# Altium schematic sheet Linear regulators.SchDoc (part 2 of 3)
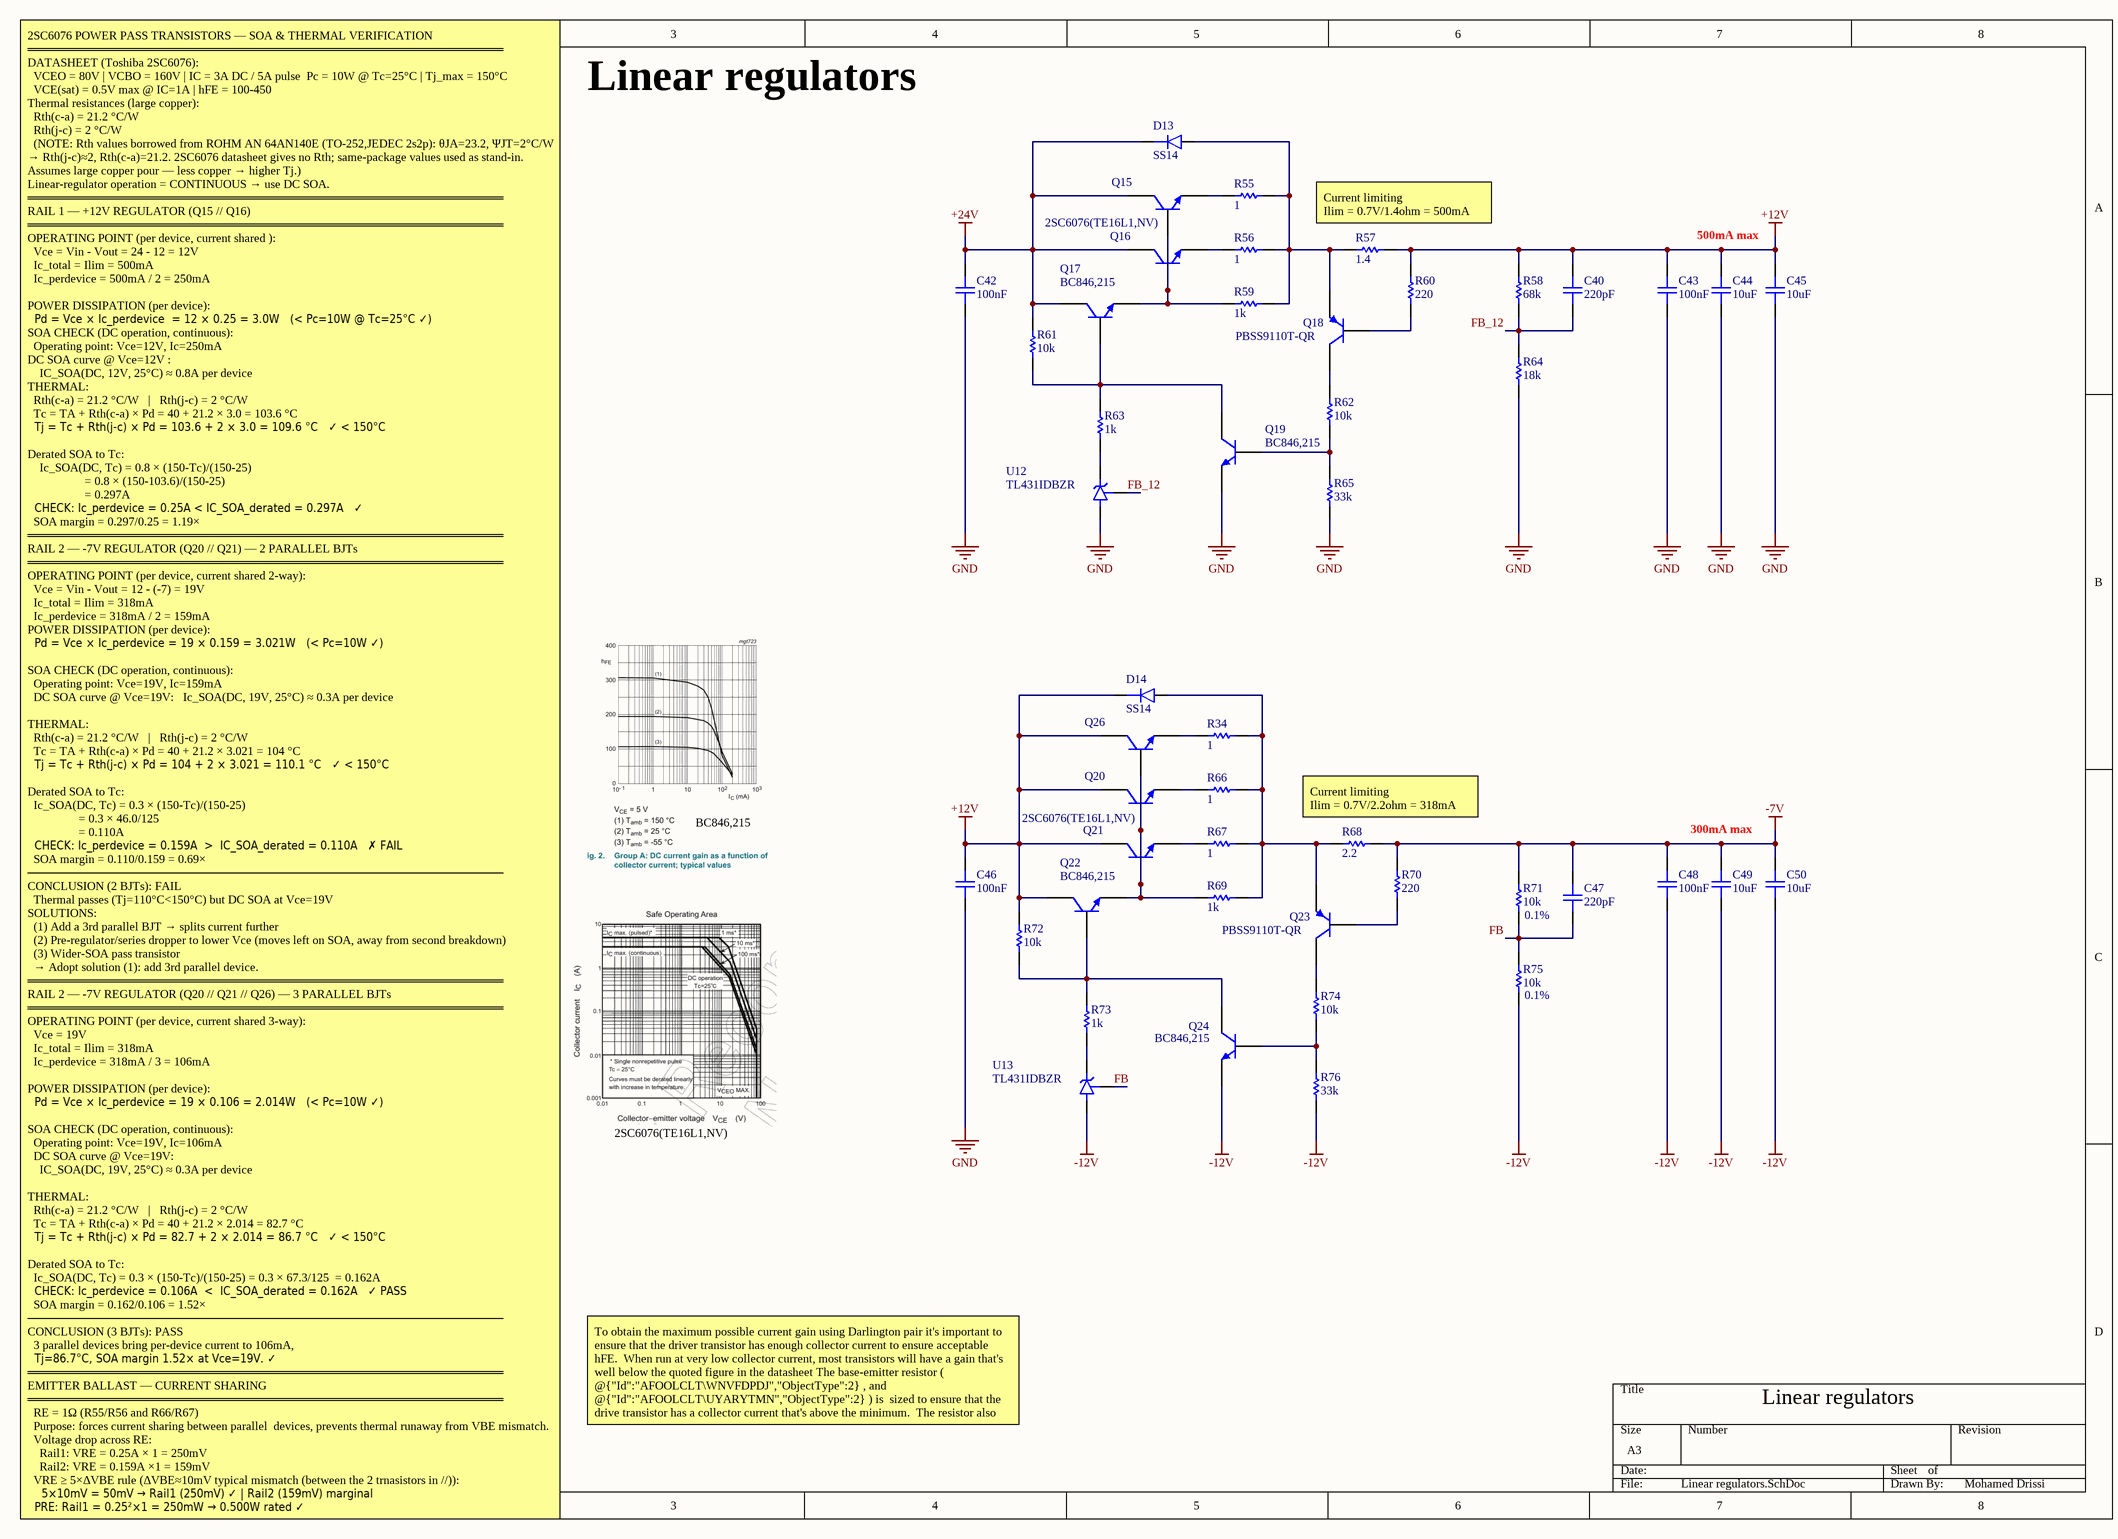
[diagram p1: Linear regulators.SchDoc]
## Library data of the parts
C40 C47 = Yageo CC0603JRNPO7BN221: 16V 220pF C0G ±5% 0603 Multilayer Ceramic Capacitors MLCC - SMD/SMT ROHS; Manufacturer: Yageo Group; Supplier: DigiKey; Supplier Part Number: 311-3948-1-ND; Manufacturer Part Number: CC0603JRNPO7BN221; RoHS: Compliant; Category: Ceramic Capacitors; Stock: 42536; Pricing: 1=0,1, 10=0,045, 50=0,0304, 100=0,0261, 500=0,0189, 1000=0,01669 (USD); Case/Package: 0603; China RoHS: Compliant; Dielectric Material: Ceramic; Halogen Free: Halogen Free; Height: 800µm; Lead Free: Lead Free; Length: 1.6mm; Lifecycle Status: Production; Max Operating Temperature: 125°C; Min Operating Temperature: -55°C; Mounting Technology: Surface Mount; Number of Terminals: 2; REACH SVHC: Yes; Thickness: 889µm; Tolerance: 5%; Voltage Rating: 16V; Voltage Rating (DC): 16V; Width: 800µm; ComponentLink1URL: https://datasheet.octopart.com:443/CC0603JRNPO7BN221-Yageo-datasheet-182140217.pdf?src-supplier=IHS; ComponentLink1Description: https://datasheet.octopart.com:443/CC0603JRNPO7BN221-Yageo-datasheet-182140217.pdf?src-supplier=IHS; ComponentLink2URL: https://datasheet.octopart.com:443/CC0603JRNPO7BN221-Yageo-datasheet-151948684.pdf?src-supplier=HQonline; ComponentLink2Description: https://datasheet.octopart.com:443/CC0603JRNPO7BN221-Yageo-datasheet-151948684.pdf?src-supplier=HQonline; ComponentLink3URL: https://datasheet.octopart.com:443/CC0603JRNPO7BN221-Yageo-datasheet-182965582.pdf?src-supplier=Farnell; ComponentLink3Description: https://datasheet.octopart.com:443/CC0603JRNPO7BN221-Yageo-datasheet-182965582.pdf?src-supplier=Farnell; ComponentLink4URL: https://datasheet.octopart.com:443/CC0603JRNPO7BN221-Yageo-datasheet-137875056.pdf?src-supplier=Future+Electronics; ComponentLink4Description: https://datasheet.octopart.com:443/CC0603JRNPO7BN221-Yageo-datasheet-137875056.pdf?src-supplier=Future+Electronics; ComponentLink5URL: http://sigma.octopart.com:80/rohs_statement/Yageo-company-2.pdf?src-supplier=Compliance+Statements; ComponentLink5Description: http://sigma.octopart.com:80/rohs_statement/Yageo-company-2.pdf?src-supplier=Compliance+Statements; ComponentLink6URL: http://sigma.octopart.com:80/conflict_mineral_statement/Yageo-company-3.pdf?src-supplier=Compliance+Statements; ComponentLink6Description: http://sigma.octopart.com:80/conflict_mineral_statement/Yageo-company-3.pdf?src-supplier=Compliance+Statements
C42 C43 C46 C48 = Cal-chip GMC10X7R104K100NT: 100V 100nF X7R ±10% 0603 Multilayer Ceramic Capacitors MLCC - SMD/SMT ROHS; Manufacturer: Cal-Chip Electronics; Supplier: DigiKey; Supplier Part Number: 4713-GMC10X7R104K100NTCT-ND; Manufacturer Part Number: GMC10X7R104K100NT; RoHS: Compliant; Category: Ceramic Capacitors; Stock: 34767; Pricing: 1=0,1, 10=0,045, 50=0,0306, 100=0,0262, 500=0,01902, 1000=0,0168 (USD); Case/Package: 0603; China RoHS: Compliant; Dielectric Material: Ceramic; Height: 950µm; Length: 1.6mm; Lifecycle Status: Production; Max Operating Temperature: 125°C; Min Operating Temperature: -55°C; Mounting Technology: Surface Mount; Number of Terminals: 2; REACH SVHC: Yes; Voltage Rating (DC): 100V; Width: 800µm; ComponentLink1URL: https://datasheet.octopart.com:443/GMC10X7R104K100NT-Cal-Chip-Electronics-datasheet-182028815.pdf?src-supplier=IHS; ComponentLink1Description: https://datasheet.octopart.com:443/GMC10X7R104K100NT-Cal-Chip-Electronics-datasheet-182028815.pdf?src-supplier=IHS
C44 C45 C49 C50 = Wurth 885012209073: Cap, 10Uf, 50V, Mlcc, 1210 Rohs Compliant: Yes |Würth Elektronik 885012209073; Manufacturer: Wurth Elektronik; Manufacturer Lifecycle Status: ACTIVE; Insulation Resistance: 10MΩ; Material: Ceramic; Tolerance: 10%; YEOL: 1 = Estimated lifetime > 10 years; Supplier: RS; Supplier Part Number: 2571123; Manufacturer Part Number: 885012209073; RoHS: Compliant; Category: Ceramic Capacitors; Stock: 1289; Pricing: 10=1,153, 100=1,081, 200=1,009, 400=0,851, 500=0,799 (EUR); Case/Package: 1210; Height: 2.5mm; Length: 3.2mm; Lifecycle Status: Production; Max Operating Temperature: 125°C; Min Operating Temperature: -55°C; Voltage Rating: 50V; Width: 2.5mm; ComponentLink1URL: https://datasheet.octopart.com:443/885012209073-Wurth-Elektronik-datasheet-166092699.pdf?src-supplier=Newark; ComponentLink1Description: https://datasheet.octopart.com:443/885012209073-Wurth-Elektronik-datasheet-166092699.pdf?src-supplier=Newark; ComponentLink2URL: https://datasheet.octopart.com:443/885012209073-W%C3%BCrth-Elektronik-datasheet-137006727.pdf?src-supplier=Wurth+Elektronik; ComponentLink2Description: https://datasheet.octopart.com:443/885012209073-W%C3%BCrth-Elektronik-datasheet-137006727.pdf?src-supplier=Wurth+Elektronik
D13 D14 = Onsemi SS14: SS14 Series 500 mV 1 A 40 V Max Reverse Voltage Schottky Rectifier - DO-214AC; Manufacturer: onsemi; Manufacturer Lifecycle Status: ACTIVE; Average Rectified Current: 1A; Element Configuration: Single; Forward Voltage: 500mV; Max Forward Surge Current (Ifsm): 30A; Max Junction Temperature (Tj): 125°C; Max Power Dissipation: 1.1W; Max Repetitive Reverse Voltage (Vrrm): 40V; Number of Elements: 1; Peak Non-Repetitive Surge Current: 40A; Peak Reverse Current: 200µA; Polarity: Standard; Voltage: 30V; Supplier: RS; Supplier Part Number: 7390467; Manufacturer Part Number: SS14; RoHS: Compliant; Category: Schottky Diodes; Stock: 1060; Pricing: 5=0,274, 50=0,236, 100=0,204, 500=0,18, 1000=0,164 (EUR); Case/Package: SMA; China RoHS: Non-Compliant; Country of Origin: Mainland China; Current: 1A; Current Rating: 1A; Export Control Classification Number (ECCN) Code: EAR99; Forward Current: 1A; Height: 2.5mm; Harmonized Tariff Schedule (HTS) Code: 8541.10.00.80; Introduction Date: 1998-01-01; Lead Free: Lead Free; Length: 4.6mm; Lifecycle Status: Production; Max Operating Temperature: 125°C; Max Output current: 1A; Max Reverse Voltage (DC): 40V; Min Operating Temperature: -65°C; Mounting Technology: Surface Mount; Pins: 2; Number of Terminals: 2; Output Current: 1A; Packaging: Cut Tape; Power Dissipation: 1.1W; Radiation Hardening: No; REACH SVHC: No; Reverse Standoff Voltage: 40V; Schedule B: 8541100080, 8541100080|8541100080|8541100080|8541100080|8541100080|8541100080|8541100080|8541100080|8541100080|8541100080|8541100080|8541100080|8541100080|8541100080|8541100080|8541100080|8541100080|8541100080|8541100080|8541100080|8541100080|8541100080|8541100080|85; Termination: SMD/SMT; Voltage Rating (DC): 40V; Weight: 105.998867mg; Width: 2.9mm; ComponentLink1URL: https://datasheet.octopart.com:443/SS14-onsemi-datasheet-180969535.pdf?src-supplier=IHS; ComponentLink1Description: https://datasheet.octopart.com:443/SS14-onsemi-datasheet-180969535.pdf?src-supplier=IHS; ComponentLink2URL: https://datasheet.octopart.com:443/SS14-Fairchild-Semiconductor-datasheet-37002494.pdf?src-supplier=IHS; ComponentLink2Description: https://datasheet.octopart.com:443/SS14-Fairchild-Semiconductor-datasheet-37002494.pdf?src-supplier=IHS; ComponentLink3URL: https://datasheet.octopart.com:443/SS14-ON-Semiconductor-datasheet-137256445.pdf?src-supplier=Electro+Sonic; ComponentLink3Description: https://datasheet.octopart.com:443/SS14-ON-Semiconductor-datasheet-137256445.pdf?src-supplier=Electro+Sonic; ComponentLink4URL: https://datasheet.octopart.com:443/SS14-ON-Semiconductor-datasheet-119409881.pdf?src-supplier=onsemi; ComponentLink4Description: https://datasheet.octopart.com:443/SS14-ON-Semiconductor-datasheet-119409881.pdf?src-supplier=onsemi; ComponentLink5URL: https://datasheet.octopart.com:443/SS14-ON-Semiconductor-datasheet-86698600.pdf?src-supplier=onsemi; ComponentLink5Description: https://datasheet.octopart.com:443/SS14-ON-Semiconductor-datasheet-86698600.pdf?src-supplier=onsemi; ComponentLink6URL: https://datasheet.octopart.com:443/SS14-ON-Semiconductor-datasheet-21199495.pdf?src-supplier=Future+Electronics; ComponentLink6Description: https://datasheet.octopart.com:443/SS14-ON-Semiconductor-datasheet-21199495.pdf?src-supplier=Future+Electronics; ComponentLink7URL: https://datasheet.octopart.com:443/SS14.-Fairchild-Semiconductor-datasheet-3545.pdf?src-supplier=element14+APAC; ComponentLink7Description: https://datasheet.octopart.com:443/SS14.-Fairchild-Semiconductor-datasheet-3545.pdf?src-supplier=element14+APAC; ComponentLink8URL: https://datasheet.octopart.com:443/SS14-Fairchild-Semiconductor-datasheet-67132011.pdf?src-supplier=element14+APAC; ComponentLink8Description: https://datasheet.octopart.com:443/SS14-Fairchild-Semiconductor-datasheet-67132011.pdf?src-supplier=element14+APAC; ComponentLink9URL: https://datasheet.octopart.com:443/SS14-Fairchild-Semiconductor-datasheet-68481721.pdf?src-supplier=element14+APAC; ComponentLink9Description: https://datasheet.octopart.com:443/SS14-Fairchild-Semiconductor-datasheet-68481721.pdf?src-supplier=element14+APAC; ComponentLink10URL: https://datasheet.octopart.com:443/SS14-onsemi-datasheet-178499215.pdf?src-supplier=Newark; ComponentLink10Description: https://datasheet.octopart.com:443/SS14-onsemi-datasheet-178499215.pdf?src-supplier=Newark; ComponentLink11URL: https://datasheet.octopart.com:443/SS14-Fairchild-Semiconductor-datasheet-67356306.pdf?src-supplier=Newark; ComponentLink11Description: https://datasheet.octopart.com:443/SS14-Fairchild-Semiconductor-datasheet-67356306.pdf?src-supplier=Newark; ComponentLink12URL: https://datasheet.octopart.com:443/SS14-Fairchild-Semiconductor-datasheet-67879033.pdf?src-supplier=Newark; ComponentLink12Description: https://datasheet.octopart.com:443/SS14-Fairchild-Semiconductor-datasheet-67879033.pdf?src-supplier=Newark; ComponentLink13URL: https://datasheet.octopart.com:443/SS14-ON-Semiconductor-datasheet-86692975.pdf?src-supplier=Farnell; ComponentLink13Description: https://datasheet.octopart.com:443/SS14-ON-Semiconductor-datasheet-86692975.pdf?src-supplier=Farnell; ComponentLink14URL: https://datasheet.octopart.com:443/SS14-onsemi-datasheet-137710389.pdf?src-supplier=TME; ComponentLink14Description: https://datasheet.octopart.com:443/SS14-onsemi-datasheet-137710389.pdf?src-supplier=TME; ComponentLink15URL: https://datasheet.octopart.com:443/SS14-ON-Semiconductor-datasheet-78863395.pdf?src-supplier=TME; ComponentLink15Description: https://datasheet.octopart.com:443/SS14-ON-Semiconductor-datasheet-78863395.pdf?src-supplier=TME; ComponentLink16URL: https://sigma.octopart.com:443/17345279/technical_drawing/Fairchild-Semiconductor-SS14..pdf?src-supplier=Fairchild+Semiconductor; ComponentLink16Description: https://sigma.octopart.com:443/17345279/technical_drawing/Fairchild-Semiconductor-SS14..pdf?src-supplier=Fairchild+Semiconductor; ComponentLink17URL: https://datasheet.octopart.com:443/SS14.-Fairchild-Semiconductor-datasheet-8381571.pdf?src-supplier=Jameco; ComponentLink17Description: https://datasheet.octopart.com:443/SS14.-Fairchild-Semiconductor-datasheet-8381571.pdf?src-supplier=Jameco; ComponentLink18URL: http://sigma.octopart.com:80/150631693/rohs_statement/ON-Semiconductor-SS14.pdf?src-supplier=Compliance+Statements; ComponentLink18Description: http://sigma.octopart.com:80/150631693/rohs_statement/ON-Semiconductor-SS14.pdf?src-supplier=Compliance+Statements; ComponentLink19URL: http://sigma.octopart.com:80/17357451/materials_sheet/Fairchild-Semiconductor-SS14..pdf?src-supplier=Compliance+Statements; ComponentLink19Description: http://sigma.octopart.com:80/17357451/materials_sheet/Fairchild-Semiconductor-SS14..pdf?src-supplier=Compliance+Statements; ComponentLink20URL: http://sigma.octopart.com:80/17357450/reach_statement/Fairchild-Semiconductor-SS14..pdf?src-supplier=Compliance+Statements; ComponentLink20Description: http://sigma.octopart.com:80/17357450/reach_statement/Fairchild-Semiconductor-SS14..pdf?src-supplier=Compliance+Statements; ComponentLink21URL: http://sigma.octopart.com:80/33331861/reach_statement/Fairchild-Semiconductor-SS14..pdf?src-supplier=Compliance+Statements; ComponentLink21Description: http://sigma.octopart.com:80/33331861/reach_statement/Fairchild-Semiconductor-SS14..pdf?src-supplier=Compliance+Statements; ComponentLink22URL: http://sigma.octopart.com:80/33331862/materials_sheet/Fairchild-Semiconductor-SS14..pdf?src-supplier=Compliance+Statements; ComponentLink22Description: http://sigma.octopart.com:80/33331862/materials_sheet/Fairchild-Semiconductor-SS14..pdf?src-supplier=Compliance+Statements; ComponentLink23URL: http://sigma.octopart.com:80/reach_statement/ON-Semiconductor-company-79.pdf?src-supplier=Compliance+Statements; ComponentLink23Description: http://sigma.octopart.com:80/reach_statement/ON-Semiconductor-company-79.pdf?src-supplier=Compliance+Statements; ComponentLink24URL: http://sigma.octopart.com:80/rohs_statement/Fairchild-Semiconductor-company-11.pdf?src-supplier=Compliance+Statements; ComponentLink24Description: http://sigma.octopart.com:80/rohs_statement/Fairchild-Semiconductor-company-11.pdf?src-supplier=Compliance+Statements; ComponentLink25URL: http://sigma.octopart.com:80/rohs_statement/Fairchild-Semiconductor-company-10.pdf?src-supplier=Compliance+Statements; ComponentLink25Description: http://sigma.octopart.com:80/rohs_statement/Fairchild-Semiconductor-company-10.pdf?src-supplier=Compliance+Statements; ComponentLink26URL: http://sigma.octopart.com:80/reach_statement/Fairchild-Semiconductor-company-9.pdf?src-supplier=Compliance+Statements; ComponentLink26Description: http://sigma.octopart.com:80/reach_statement/Fairchild-Semiconductor-company-9.pdf?src-supplier=Compliance+Statements; ComponentLink27URL: https://octopart.com:443/opatz8j6/c1?t=Bw0gF7dTHBBNgIRwmL-w_2CyYL2SBkPqmv81bh-l31_h4wWg3_a04vj5nygZPKjJEbqCn-V3QJKPEtJbJZ9dK76nf60b1hnFYSb2utlv1JMZ7nt7LZDcLJB6MnS0HXUMNymQ9MKHht22UTBn3FPLIAeU_nKjXm585aLMzgts1grjV1usOojzByqPrb06YMMbaH2DemZtlAMpdE8kThGW13fMNBaSLxUaqaEw9yCul6wsHG4N0hle5kO4fDo68Lm_qc0J9mjVS1cKqi_KRYcR4HzMEZdKKCtujOS1LtQ51mEG8ds8yMcLACJrlGl72MtFCtRQExHmh1A08LYIe9nE1jxUQxpaAYU&src-supplier=Compliance+Statements; ComponentLink27Description: https://octopart.com:443/opatz8j6/c1?t=Bw0gF7dTHBBNgIRwmL-w_2CyYL2SBkPqmv81bh-l31_h4wWg3_a04vj5nygZPKjJEbqCn-V3QJKPEtJbJZ9dK76nf60b1hnFYSb2utlv1JMZ7nt7LZDcLJB6MnS0HXUMNymQ9MKHht22UTBn3FPLIAeU_nKjXm585aLMzgts1grjV1usOojzByqPrb06YMMbaH2DemZtlAMpdE8kThGW13fMNBaSLxUaqaEw9yCul6wsHG4N0hle5kO4fDo68Lm_qc0J9mjVS1cKqi_KRYcR4HzMEZdKKCtujOS1LtQ51mEG8ds8yMcLACJrlGl72MtFCtRQExHmh1A08LYIe9nE1jxUQxpaAYU&src-supplier=Compliance+Statements; ComponentLink28URL: https://octopart.com:443/opatz8j6/c1?t=Oy9Y_xQ8UBTUdj6PwzXwp1zs71_1odZp0ZU_YgdGe4cRGR2grA12wzMk0vFreugSMOPhDRboFjT3DxMxky9bE1pRs3RzwJ4HuhrWPX0Rvf9JkcZ-KzK2E-hTxLa87m8fCG3QDeTdPLKe0q9nCHkQ9Fq-P1zjt1qPa8QNtTjCwRNLV7KQZ0akwYUkHij7z86lA5yyHwuacyylqSQdeLnxu4qSYfmPMgjMEw-ejaQVRBCjOvHtUB15Vc3ByBR5f7PieHEl4NkUuljoGV4a9YtBLQqKu7wBh9trMegOXFlGaLSEvBsdfJivtg_oNHsdlAJBiRoCdT3_Ib8N5sEl_iSFZc4efKmkxQ&src-supplier=Compliance+Statements; ComponentLink28Description: https://octopart.com:443/opatz8j6/c1?t=Oy9Y_xQ8UBTUdj6PwzXwp1zs71_1odZp0ZU_YgdGe4cRGR2grA12wzMk0vFreugSMOPhDRboFjT3DxMxky9bE1pRs3RzwJ4HuhrWPX0Rvf9JkcZ-KzK2E-hTxLa87m8fCG3QDeTdPLKe0q9nCHkQ9Fq-P1zjt1qPa8QNtTjCwRNLV7KQZ0akwYUkHij7z86lA5yyHwuacyylqSQdeLnxu4qSYfmPMgjMEw-ejaQVRBCjOvHtUB15Vc3ByBR5f7PieHEl4NkUuljoGV4a9YtBLQqKu7wBh9trMegOXFlGaLSEvBsdfJivtg_oNHsdlAJBiRoCdT3_Ib8N5sEl_iSFZc4efKmkxQ&src-supplier=Compliance+Statements
Q15 Q16 Q20 Q21 Q26 = Toshihba 2SC6076(TE16L1,NV): Power Bipolar Transistor, 3A I(C), 80V V(BR)CEO, 1-Element, NPN, Silicon, Plastic/Epoxy, 2 Pin; Manufacturer: Toshiba; Collector Emitter Saturation Voltage: 500mV; hFE Min: 100; Max Power Dissipation: 10W; Number of Elements: 1; Transition Frequency: 150MHz; Supplier: DigiKey; Supplier Part Number: 2SC6076(TE16L1NV)CT-ND; Manufacturer Part Number: 2SC6076(TE16L1,NV); RoHS: Compliant; Category: BJTs; Stock: 1540; Pricing: 1=0,96, 10=0,599, 100=0,3888, 500=0,29846, 1000=0,26933 (USD); Case/Package: TO-252-3; Collector Emitter Breakdown Voltage: 80V; Collector Emitter Voltage (VCEO): 80V; Export Control Classification Number (ECCN) Code: EAR99; Introduction Date: 2009-12-22; Lifecycle Status: NRND; Max Breakdown Voltage: 80V; Max Collector Current: 3A; Max Operating Temperature: 150°C; Mounting Technology: Surface Mount; Number of Terminals: 2; ComponentLink1URL: https://datasheet.octopart.com:443/2SC6076%28TE16L1%2CNV%29-Toshiba-datasheet-181388478.pdf?src-supplier=IHS; ComponentLink1Description: https://datasheet.octopart.com:443/2SC6076%28TE16L1%2CNV%29-Toshiba-datasheet-181388478.pdf?src-supplier=IHS
Q17 Q19 Q22 Q24 = NXP BC846,215: BC846 Series 65 V 100 mA SMT NPN General Purpose Transistor - SOT-23; Manufacturer: Nexperia; Manufacturer Lifecycle Status: RELEASED FOR SUPPLY; Collector Base Voltage (VCBO): 80V; Collector Emitter Breakdown Voltage: 65V; Collector Emitter Saturation Voltage: 600mV; Element Configuration: Single; Emitter Base Voltage (VEBO): 6V; Frequency: 100MHz; hFE Min: 110; Max Collector Current: 100mA; Max Power Dissipation: 250mW; Number of Elements: 1; Supplier: RS; Supplier Part Number: 4842268P; Manufacturer Part Number: BC846,215; RoHS: Compliant; Category: BJTs; Stock: 24450; Pricing: 100=0,103, 250=0,091 (EUR); Case/Package: SOT-23; China RoHS: Compliant; Collector Emitter Voltage (VCEO): 65V; Contact Plating: Tin; Country of Origin: Mainland China; Export Control Classification Number (ECCN) Code: EAR99; Gain Bandwidth Product: 100MHz; Height: 1mm; Harmonized Tariff Schedule (HTS) Code: 8541.21.00.95; Introduction Date: 1997-09-01; Lead Free: Lead Free; Length: 3mm; Lifecycle Status: Production; Max Breakdown Voltage: 65V; Clock Frequency: 100MHz; Max Operating Temperature: 150°C; Min Operating Temperature: -65°C; Mounting Technology: Surface Mount; Pins: 3; Number of Terminals: 3; Packaging: Cut Tape; Polarity: NPN; Power Dissipation: 250mW; Radiation Hardening: No; REACH SVHC: Yes; Schedule B: 8541210080, 8541210080|8541210080|8541210080|8541210080|8541210080|8541210080|8541210080|8541210080|8541210080|8541210080|8541210080|8541210080|8541210080|8541210080|8541210080|8541210080|8541210080, 8541210080|8541210080|8541210080|8541210080|8541210080|8541210080|8541210080|8541210080|8541210080|8541210080|8541210080|8541210080|8541210080|8541210080|8541210080|8541210080|8541210080|8541210080, 8541210080|8541210080|8541210080|8541210080|8541210080|8541210080|8541210080|8541210080|8541210080|8541210080|8541210080|8541210080|8541210080|8541210080|8541210080|8541210080|8541210080|8541210080|8541210080; Transition Frequency: 100MHz; Weight: 4.535924g; Width: 1.4mm; ComponentLink1URL: https://datasheet.octopart.com:443/BC846%2C215-Nexperia-datasheet-158761168.pdf?src-supplier=Future+Electronics; ComponentLink1Description: https://datasheet.octopart.com:443/BC846%2C215-Nexperia-datasheet-158761168.pdf?src-supplier=Future+Electronics; ComponentLink2URL: https://datasheet.octopart.com:443/BC846%2C215-Nexperia-datasheet-12520503.pdf?src-supplier=IHS; ComponentLink2Description: https://datasheet.octopart.com:443/BC846%2C215-Nexperia-datasheet-12520503.pdf?src-supplier=IHS; ComponentLink3URL: https://datasheet.octopart.com:443/BC846%2C215-Nexperia-datasheet-116120539.pdf?src-supplier=IHS; ComponentLink3Description: https://datasheet.octopart.com:443/BC846%2C215-Nexperia-datasheet-116120539.pdf?src-supplier=IHS; ComponentLink4URL: https://datasheet.octopart.com:443/BC846%2C215-Nexperia-datasheet-87580894.pdf?src-supplier=Newark; ComponentLink4Description: https://datasheet.octopart.com:443/BC846%2C215-Nexperia-datasheet-87580894.pdf?src-supplier=Newark; ComponentLink5URL: https://datasheet.octopart.com:443/BC846%2C215-NXP-Semiconductors-datasheet-8530246.pdf?src-supplier=Arrow+Electronics; ComponentLink5Description: https://datasheet.octopart.com:443/BC846%2C215-NXP-Semiconductors-datasheet-8530246.pdf?src-supplier=Arrow+Electronics; ComponentLink6URL: https://datasheet.octopart.com:443/BC846%2C215-NXP-Semiconductors-datasheet-20734450.pdf?src-supplier=Farnell; ComponentLink6Description: https://datasheet.octopart.com:443/BC846%2C215-NXP-Semiconductors-datasheet-20734450.pdf?src-supplier=Farnell; ComponentLink7URL: http://sigma.octopart.com:80/reach_statement/NXP-Semiconductors-company-13.pdf?src-supplier=Compliance+Statements; ComponentLink7Description: http://sigma.octopart.com:80/reach_statement/NXP-Semiconductors-company-13.pdf?src-supplier=Compliance+Statements; ComponentLink8URL: http://sigma.octopart.com:80/rohs_statement/NXP-Semiconductors-company-12.pdf?src-supplier=Compliance+Statements; ComponentLink8Description: http://sigma.octopart.com:80/rohs_statement/NXP-Semiconductors-company-12.pdf?src-supplier=Compliance+Statements
Q18 Q23 = NXP PBSS9110T-QR: Bipolar Transistors - BJT 100 V, 1 A PNP low VCEsat transistor; Manufacturer: Nexperia; Manufacturer Lifecycle Status: RELEASED FOR SUPPLY; Supplier: DigiKey; Supplier Part Number: 1727-PBSS9110T-QRTR-ND; Manufacturer Part Number: PBSS9110T-QR; Category: Uncategorized; Stock: 6000; Pricing: 3000=0,08942, 6000=0,08095, 9000=0,07663, 15000=0,07178, 21000=0,07176 (USD); Lifecycle Status: Production; ComponentLink1URL: https://datasheet.octopart.com:443/PBSS9110T-QR-Nexperia-datasheet-163260084.pdf?src-supplier=Nexperia; ComponentLink1Description: https://datasheet.octopart.com:443/PBSS9110T-QR-Nexperia-datasheet-163260084.pdf?src-supplier=Nexperia
R34 R55 R56 R66 R67 = Vishay RCS06031R00JNEA: SMD Chip Resistor, 1 Ohm, ± 5%, 500 mW, 0603 [1608 Metric], Thick Film, Anti-Surge; Manufacturer: Vishay; Max Power Dissipation: 500mW; Power Rating: 250mW; Temperature Coefficient: 200ppm/°C; Working Voltage: 75V; Supplier: DigiKey; Supplier Part Number: 541-2805-1-ND; Manufacturer Part Number: RCS06031R00JNEA; RoHS: Compliant; Category: Chip SMD Resistors; Stock: 2900; Pricing: 1=0,17, 10=0,081, 25=0,0636, 50=0,0536, 100=0,0457, 250=0,03772, 500=0,03316, 1000=0,02955 (USD); Case/Package: 0603; Case Code (Imperial): 0603; Case Code (Metric): 1608; China RoHS: Non-Compliant; Composition: Thick Film; Country of Origin: Israel, Mainland China; Export Control Classification Number (ECCN) Code: EAR99; Features: Automotive AEC-Q200; Height: 450µm; Harmonized Tariff Schedule (HTS) Code: 8533.21.00.30; Introduction Date: 2016-07-12; Length: 1.55mm; Lifecycle Status: Production; Max Operating Temperature: 155°C; Min Operating Temperature: -55°C; Mounting Technology: Surface Mount; Number of Terminals: 2; Number of Terminations: 2; Ratings: AEC-Q200; REACH SVHC: Yes; Schedule B: 8533210045, 8533210045|8533210045|8533210045|8533210045|8533210045; Tolerance: 5%; Width: 850µm; ComponentLink1URL: https://datasheet.octopart.com:443/RCS06031R00JNEA-Vishay-datasheet-176436275.pdf?src-supplier=IHS; ComponentLink1Description: https://datasheet.octopart.com:443/RCS06031R00JNEA-Vishay-datasheet-176436275.pdf?src-supplier=IHS; ComponentLink2URL: http://sigma.octopart.com:80/rohs_statement/Vishay-company-15.pdf?src-supplier=Compliance+Statements; ComponentLink2Description: http://sigma.octopart.com:80/rohs_statement/Vishay-company-15.pdf?src-supplier=Compliance+Statements
R57 = Vishay CRCW12061R40FKEAHP: Res Thick Film 1206 1.4 Ohm 1% 0.75W(3/4W) ±100ppm/C Pad SMD Automotive T/R; Manufacturer: Vishay; Max Power Dissipation: 500mW; Power Rating: 750mW; Temperature Coefficient: 100ppm/°C; Voltage Rating: 200V; Supplier: Future Electronics; Supplier Part Number: CRCW12061R40FKEAHP; Manufacturer Part Number: CRCW12061R40FKEAHP; RoHS: Compliant; Category: Chip SMD Resistors; Stock: 5000; Pricing: 5000=0,0554, 10000=0,0545, 15000=0,054, 20000=0,0536, 25000=0,0524 (USD); Case/Package: 1206; Case Code (Imperial): 1206; Case Code (Metric): 3216; China RoHS: Non-Compliant; Composition: Thick Film; Features: Automotive AEC-Q200; Height: 500µm; Lead Free: Lead Free; Length: 3.1mm; Lifecycle Status: Production; Max Operating Temperature: 155°C; Min Operating Temperature: -55°C; Mounting Technology: Surface Mount; Number of Terminals: 2; Number of Terminations: 2; Packaging: Cut Tape (CT); Ratings: AEC-Q200; REACH SVHC: Yes; Schedule B: 8533210045, 8533210045|8533210045|8533210045|8533210045|8533210045; Tolerance: 1%; Width: 1.6mm; Working Voltage: 200V; ComponentLink1URL: https://datasheet.octopart.com:443/CRCW12061R40FKEAHP-Vishay-datasheet-83567917.pdf?src-supplier=Upverter; ComponentLink1Description: https://datasheet.octopart.com:443/CRCW12061R40FKEAHP-Vishay-datasheet-83567917.pdf?src-supplier=Upverter; ComponentLink2URL: https://datasheet.octopart.com:443/CRCW12061R40FKEAHP-Vishay-datasheet-62316122.pdf?src-supplier=Future+Electronics; ComponentLink2Description: https://datasheet.octopart.com:443/CRCW12061R40FKEAHP-Vishay-datasheet-62316122.pdf?src-supplier=Future+Electronics; ComponentLink3URL: https://datasheet.octopart.com/D-CRCW-e3-Standard-Thick-Film-Chip-Resistors-Vishay-datasheet-family-64.pdf; ComponentLink3Description: https://datasheet.octopart.com/D-CRCW-e3-Standard-Thick-Film-Chip-Resistors-Vishay-datasheet-family-64.pdf; ComponentLink4URL: http://sigma.octopart.com:80/rohs_certificate/D-CRCW-e3-Standard-Thick-Film-Chip-Resistors-Vishay-family-102.pdf?src-supplier=Compliance+Statements; ComponentLink4Description: http://sigma.octopart.com:80/rohs_certificate/D-CRCW-e3-Standard-Thick-Film-Chip-Resistors-Vishay-family-102.pdf?src-supplier=Compliance+Statements
R58 = TE CRGCQ0603J68K: Res Thick Film 0603 68K Ohm 5% 0.1W(1/10W) ±100ppm/C Pad SMD Automotive T/R; Manufacturer: TE Connectivity; Manufacturer Lifecycle Status: ACTIVE; Operating Supply Voltage: 75V; Power Rating: 100mW; Temperature Coefficient: 100ppm/°C; Supplier: Farnell; Supplier Part Number: CRGCQ0603J68K; Manufacturer Part Number: CRGCQ0603J68K; RoHS: Compliant; Category: Chip SMD Resistors; Stock: 5233; Pricing: 10=0,010, 250=0,0053, 1000=0,0035, 5000=0,003, 12000=0,0023, 24000=0,0022 (GBP); Ambient Temperature Range High: 70°C; Case/Package: 0603; China RoHS: Non-Compliant; Composition: Thick Film; Export Control Classification Number (ECCN) Code: EAR99; Height: 450µm; Harmonized Tariff Schedule (HTS) Code: 8533.21.00.30; Introduction Date: 2018-03-13; Length: 1.6mm; Lifecycle Status: Production; Max Operating Temperature: 155°C; Min Operating Temperature: -55°C; Mounting Technology: Surface Mount; Number of Terminals: 2; Packaging: Cut Tape; Ratings: AEC-Q200; REACH SVHC: Yes; Schedule B: 8533210045; Tolerance: 5%; Voltage Rating: 75V; Voltage Rating (DC): 75V; Width: 800µm; Working Voltage: 75V; ComponentLink1URL: https://datasheet.octopart.com:443/CRGCQ0603J68K-TE-Connectivity-datasheet-114679081.pdf?src-supplier=Master+Electronics; ComponentLink1Description: https://datasheet.octopart.com:443/CRGCQ0603J68K-TE-Connectivity-datasheet-114679081.pdf?src-supplier=Master+Electronics; ComponentLink2URL: https://sigma.octopart.com:443/114692702/technical_drawing/TE-Connectivity-CRGCQ0603J68K.pdf?src-supplier=Sager+Electronics; ComponentLink2Description: https://sigma.octopart.com:443/114692702/technical_drawing/TE-Connectivity-CRGCQ0603J68K.pdf?src-supplier=Sager+Electronics
R59 R63 R69 R73 = Yageo RC0603FR-071KL: Res Thick Film 0603 1K Ohm 1% 0.1W(1/10W) ±100ppm/°C Pad SMD T/R / RES SMD 1K OHM 1% 1/10W 0603; Manufacturer: Yageo Group; Power Rating: 100mW; Voltage Rating: 50V; Working Voltage: 75V; Supplier: RS; Supplier Part Number: 1995479P; Manufacturer Part Number: RC0603FR-071KL; RoHS: Compliant; Category: Chip SMD Resistors; Stock: 83300; Pricing: 1000=0,007, 2500=0,007, 5000=0,006, 10000=0,005 (EUR); Case/Package: 0603; Case Code (Imperial): 0603; Case Code (Metric): 0603; China RoHS: Non-Compliant; Composition: Thick Film; Contact Plating: Tin; Country of Origin: Mainland China, Taiwan; Depth: 800µm; Export Control Classification Number (ECCN) Code: EAR99; Height: 450µm; Harmonized Tariff Schedule (HTS) Code: 8533.21.00.30; Introduction Date: 2004-10-04; Lead Free: Lead Free; Length: 1.6mm; Lifecycle Status: Production; Max Operating Temperature: 155°C; Military Standard: Not; Min Operating Temperature: -55°C; Mounting Technology: Surface Mount; Pins: 2; Number of Terminals: 2; Packaging: Tape and Reel; Radiation Hardening: No; REACH SVHC: Yes; Schedule B: 8533210045, 8533210045|8533210045|8533210045|8533210045|8533210045|8533210045|8533210045|8533210045|8533210045|8533210045|8533210045|8533210045|8533210045|8533210045|8533210045|8533210045|8533210045|8533210045|8533210045|8533210045|8533210045|8533210045|8533210045|85; Temperature Coefficient: 100ppm/°C; Termination: SMD/SMT; Tolerance: 1%; Voltage Rating (DC): 50V; Width: 800µm; ComponentLink1URL: https://datasheet.octopart.com:443/RC0603FR-071KL-Yageo-datasheet-175887523.pdf?src-supplier=Newark; ComponentLink1Description: https://datasheet.octopart.com:443/RC0603FR-071KL-Yageo-datasheet-175887523.pdf?src-supplier=Newark; ComponentLink2URL: https://datasheet.octopart.com:443/RC0603FR-071KL-Yageo-datasheet-34211833.pdf?src-supplier=Newark; ComponentLink2Description: https://datasheet.octopart.com:443/RC0603FR-071KL-Yageo-datasheet-34211833.pdf?src-supplier=Newark; ComponentLink3URL: https://datasheet.octopart.com:443/RC0603FR-071KL-Yageo-datasheet-12596169.pdf?src-supplier=Newark; ComponentLink3Description: https://datasheet.octopart.com:443/RC0603FR-071KL-Yageo-datasheet-12596169.pdf?src-supplier=Newark; ComponentLink4URL: https://datasheet.octopart.com:443/RC0603FR-071KL-Yageo-datasheet-499455.pdf?src-supplier=Newark; ComponentLink4Description: https://datasheet.octopart.com:443/RC0603FR-071KL-Yageo-datasheet-499455.pdf?src-supplier=Newark; ComponentLink5URL: https://datasheet.octopart.com:443/RC0603FR-071KL-Yageo-datasheet-503470.pdf?src-supplier=Newark; ComponentLink5Description: https://datasheet.octopart.com:443/RC0603FR-071KL-Yageo-datasheet-503470.pdf?src-supplier=Newark; ComponentLink6URL: https://datasheet.octopart.com:443/RC0603FR-071KL-Yageo-datasheet-62067350.pdf?src-supplier=element14+APAC; ComponentLink6Description: https://datasheet.octopart.com:443/RC0603FR-071KL-Yageo-datasheet-62067350.pdf?src-supplier=element14+APAC; ComponentLink7URL: https://datasheet.octopart.com:443/RC0603FR-071KL-Yageo-datasheet-21426514.pdf?src-supplier=element14+APAC; ComponentLink7Description: https://datasheet.octopart.com:443/RC0603FR-071KL-Yageo-datasheet-21426514.pdf?src-supplier=element14+APAC; ComponentLink8URL: https://datasheet.octopart.com:443/RC0603FR-071KL-Yageo-datasheet-141265859.pdf?src-supplier=Upverter; ComponentLink8Description: https://datasheet.octopart.com:443/RC0603FR-071KL-Yageo-datasheet-141265859.pdf?src-supplier=Upverter; ComponentLink9URL: https://datasheet.octopart.com:443/RC0603FR-071KL-Yageo-datasheet-103092701.pdf?src-supplier=Upverter; ComponentLink9Description: https://datasheet.octopart.com:443/RC0603FR-071KL-Yageo-datasheet-103092701.pdf?src-supplier=Upverter; ComponentLink10URL: https://sigma.octopart.com:443/138820526/technical_drawing/Yageo-RC0603FR-071KL.pdf?src-supplier=Upverter; ComponentLink10Description: https://sigma.octopart.com:443/138820526/technical_drawing/Yageo-RC0603FR-071KL.pdf?src-supplier=Upverter; ComponentLink11URL: https://datasheet.octopart.com:443/RC0603FR-071KL-Yageo-datasheet-68297981.pdf?src-supplier=Upverter; ComponentLink11Description: https://datasheet.octopart.com:443/RC0603FR-071KL-Yageo-datasheet-68297981.pdf?src-supplier=Upverter; ComponentLink12URL: https://datasheet.octopart.com:443/RC0603FR-071KL-Yageo-datasheet-8328172.pdf?src-supplier=Farnell; ComponentLink12Description: https://datasheet.octopart.com:443/RC0603FR-071KL-Yageo-datasheet-8328172.pdf?src-supplier=Farnell; ComponentLink13URL: https://datasheet.octopart.com:443/RC0603FR-071KL-Yageo-datasheet-13691069.pdf?src-supplier=Farnell; ComponentLink13Description: https://datasheet.octopart.com:443/RC0603FR-071KL-Yageo-datasheet-13691069.pdf?src-supplier=Farnell; ComponentLink14URL: https://datasheet.octopart.com:443/RC0603FR-071KL-Yageo-datasheet-15599030.pdf?src-supplier=Seeed+Studio; ComponentLink14Description: https://datasheet.octopart.com:443/RC0603FR-071KL-Yageo-datasheet-15599030.pdf?src-supplier=Seeed+Studio; ComponentLink15URL: https://datasheet.octopart.com:443/RC0603FR-071KL-Yageo-Group-datasheet-176638170.pdf?src-supplier=Future+Electronics; ComponentLink15Description: https://datasheet.octopart.com:443/RC0603FR-071KL-Yageo-Group-datasheet-176638170.pdf?src-supplier=Future+Electronics; ComponentLink16URL: https://datasheet.octopart.com:443/RC0603FR-071KL-Yageo-datasheet-164759695.pdf?src-supplier=Future+Electronics; ComponentLink16Description: https://datasheet.octopart.com:443/RC0603FR-071KL-Yageo-datasheet-164759695.pdf?src-supplier=Future+Electronics; ComponentLink17URL: https://datasheet.octopart.com:443/RC0603FR-071KL-Yageo-datasheet-137700087.pdf?src-supplier=Future+Electronics; ComponentLink17Description: https://datasheet.octopart.com:443/RC0603FR-071KL-Yageo-datasheet-137700087.pdf?src-supplier=Future+Electronics; ComponentLink18URL: https://datasheet.octopart.com:443/RC0603FR071KL-Yageo-datasheet-27584510.pdf?src-supplier=Future+Electronics; ComponentLink18Description: https://datasheet.octopart.com:443/RC0603FR071KL-Yageo-datasheet-27584510.pdf?src-supplier=Future+Electronics; ComponentLink19URL: https://datasheet.octopart.com:443/RC0603FR-071KL-Yageo-datasheet-8324193.pdf?src-supplier=Future+Electronics; ComponentLink19Description: https://datasheet.octopart.com:443/RC0603FR-071KL-Yageo-datasheet-8324193.pdf?src-supplier=Future+Electronics; ComponentLink20URL: https://datasheet.octopart.com:443/RC0603FR-071KL-Yageo-datasheet-79472498.pdf?src-supplier=Megastar; ComponentLink20Description: https://datasheet.octopart.com:443/RC0603FR-071KL-Yageo-datasheet-79472498.pdf?src-supplier=Megastar; ComponentLink21URL: https://datasheet.octopart.com/RC0603FR-071KL-Yageo-datasheet-73766026.pdf; ComponentLink21Description: https://datasheet.octopart.com/RC0603FR-071KL-Yageo-datasheet-73766026.pdf; ComponentLink22URL: https://datasheet.octopart.com:443/RC0603FR-071KL-Yageo-datasheet-118562.pdf?src-supplier=DigiKey; ComponentLink22Description: https://datasheet.octopart.com:443/RC0603FR-071KL-Yageo-datasheet-118562.pdf?src-supplier=DigiKey; ComponentLink23URL: http://sigma.octopart.com:80/conflict_mineral_statement/Yageo-company-3.pdf?src-supplier=Compliance+Statements; ComponentLink23Description: http://sigma.octopart.com:80/conflict_mineral_statement/Yageo-company-3.pdf?src-supplier=Compliance+Statements; ComponentLink24URL: http://sigma.octopart.com:80/rohs_statement/Yageo-company-2.pdf?src-supplier=Compliance+Statements; ComponentLink24Description: http://sigma.octopart.com:80/rohs_statement/Yageo-company-2.pdf?src-supplier=Compliance+Statements
R60 R70 = TE CRGCQ0603J220R: Res Thick Film 0603 220 Ohm 5% 0.1W(1/10W) ±100ppm/C Pad SMD Automotive T/R; Manufacturer: TE Connectivity; Manufacturer Lifecycle Status: ACTIVE; Operating Supply Voltage: 75V; Power Rating: 100mW; Temperature Coefficient: 100ppm/°C; Supplier: Farnell; Supplier Part Number: CRGCQ0603J220R; Manufacturer Part Number: CRGCQ0603J220R; RoHS: Compliant; Category: Chip SMD Resistors; Stock: 13500; Pricing: 10=0,010, 250=0,0053, 1000=0,0035, 5000=0,003, 10000=0,0023, 20000=0,0022 (GBP); Ambient Temperature Range High: 70°C; Case/Package: 0603; China RoHS: Non-Compliant; Composition: Thick Film; Export Control Classification Number (ECCN) Code: EAR99; Height: 450µm; Harmonized Tariff Schedule (HTS) Code: 8533.21.00.30; Introduction Date: 2018-03-13; Length: 1.6mm; Lifecycle Status: Production; Max Operating Temperature: 155°C; Min Operating Temperature: -55°C; Mounting Technology: Surface Mount; Number of Terminals: 2; Packaging: Cut Tape; Ratings: AEC-Q200; REACH SVHC: Yes; Schedule B: 8533210025, 8533210025|8533210025|8533210025|8533210025|8533210025, 8533210045; Tolerance: 5%; Voltage Rating: 75V; Voltage Rating (DC): 75V; Width: 800µm; Working Voltage: 75V; ComponentLink1URL: https://datasheet.octopart.com:443/CRGCQ0603J220R-TE-Connectivity-datasheet-114679081.pdf?src-supplier=Master+Electronics; ComponentLink1Description: https://datasheet.octopart.com:443/CRGCQ0603J220R-TE-Connectivity-datasheet-114679081.pdf?src-supplier=Master+Electronics; ComponentLink2URL: https://datasheet.octopart.com:443/CRGCQ0603J220R-TE-Connectivity-datasheet-179146981.pdf?src-supplier=IHS; ComponentLink2Description: https://datasheet.octopart.com:443/CRGCQ0603J220R-TE-Connectivity-datasheet-179146981.pdf?src-supplier=IHS; ComponentLink3URL: https://sigma.octopart.com:443/114692702/technical_drawing/TE-Connectivity-CRGCQ0603J220R.pdf?src-supplier=Sager+Electronics; ComponentLink3Description: https://sigma.octopart.com:443/114692702/technical_drawing/TE-Connectivity-CRGCQ0603J220R.pdf?src-supplier=Sager+Electronics
R61 R62 R71 R72 R74 R75 = Panasonic ERA-3AEB103V: Res Thin Film 0603 10K Ohm 0.1% 1/10W ±25ppm/°C Molded SMD SMD Punched Carrier T/R; Manufacturer Lifecycle Status: ACTIVE; Part Series: Thin Film Chip Resistors, High Reliability Type; Max Power Dissipation: 100mW; Voltage Rating: 75V; Supplier: RS; Supplier Part Number: 566890P; Manufacturer: Panasonic; Manufacturer Part Number: ERA-3AEB103V; RoHS: Compliant; Category: Chip SMD Resistors; Stock: 165600; Pricing: 50=0,056, 100=0,046, 250=0,04, 500=0,036 (EUR); Case/Package: 0603; Case Code (Imperial): 0603; Composition: Thin Film; Contact Plating: Tin; Country of Origin: Japan; Depth: 800µm; Export Control Classification Number (ECCN) Code: EAR99; Height: 450µm; Harmonized Tariff Schedule (HTS) Code: 8533.21.00.30; Introduction Date: 2008-03-19; Lead Free: Lead Free; Length: 1.6mm; Lifecycle Status: Production; Max Operating Temperature: 155°C; Military Standard: Not; Min Operating Temperature: -55°C; Mounting Technology: Surface Mount; Pins: 2; Number of Terminals: 2; Number of Terminations: 2; Packaging: Cut Tape; Power Rating: 100mW; Radiation Hardening: No; Ratings: AEC-Q200; REACH SVHC: Yes; Schedule B: 8533210045, 8533210045|8533210045|8533210045|8533210045|8533210045|8533210045|8533210045|8533210045|8533210045|8533210045|8533210045|8533210045|8533210045|8533210045|8533210045|8533210045|8533210045|8533210045|8533210045|8533210045|8533210045|8533210045|8533210045|85; Temperature Coefficient: 25ppm/°C; Termination: SMD/SMT; Voltage Rating (DC): 75V; Width: 800µm; Working Voltage: 75V; ComponentLink1URL: https://datasheet.octopart.com:443/ERA-3AEB103V-Panasonic-datasheet-62287448.pdf?src-supplier=Newark; ComponentLink1Description: https://datasheet.octopart.com:443/ERA-3AEB103V-Panasonic-datasheet-62287448.pdf?src-supplier=Newark; ComponentLink2URL: https://datasheet.octopart.com:443/ERA-3AEB103V-Panasonic-datasheet-118567.pdf?src-supplier=Newark; ComponentLink2Description: https://datasheet.octopart.com:443/ERA-3AEB103V-Panasonic-datasheet-118567.pdf?src-supplier=Newark; ComponentLink3URL: https://datasheet.octopart.com:443/ERA-3AEB103V-Panasonic-datasheet-61114971.pdf?src-supplier=Newark; ComponentLink3Description: https://datasheet.octopart.com:443/ERA-3AEB103V-Panasonic-datasheet-61114971.pdf?src-supplier=Newark; ComponentLink4URL: https://datasheet.octopart.com:443/ERA3AEB103V-Panasonic-datasheet-22087624.pdf?src-supplier=Newark; ComponentLink4Description: https://datasheet.octopart.com:443/ERA3AEB103V-Panasonic-datasheet-22087624.pdf?src-supplier=Newark; ComponentLink5URL: https://sigma.octopart.com:443/138766958/technical_drawing/Panasonic-ERA-3AEB103V.pdf?src-supplier=Upverter; ComponentLink5Description: https://sigma.octopart.com:443/138766958/technical_drawing/Panasonic-ERA-3AEB103V.pdf?src-supplier=Upverter; ComponentLink6URL: https://datasheet.octopart.com:443/ERA-3AEB103V-Panasonic-datasheet-136531316.pdf?src-supplier=Farnell; ComponentLink6Description: https://datasheet.octopart.com:443/ERA-3AEB103V-Panasonic-datasheet-136531316.pdf?src-supplier=Farnell; ComponentLink7URL: https://datasheet.octopart.com:443/ERA-3AEB103V-Panasonic-datasheet-13266200.pdf?src-supplier=RS+(Formerly+Allied+Electronics); ComponentLink7Description: https://datasheet.octopart.com:443/ERA-3AEB103V-Panasonic-datasheet-13266200.pdf?src-supplier=RS+(Formerly+Allied+Electronics); ComponentLink8URL: https://datasheet.octopart.com:443/ERA-3AEB103V-Panasonic-datasheet-46744048.pdf?src-supplier=RS+(Formerly+Allied+Electronics); ComponentLink8Description: https://datasheet.octopart.com:443/ERA-3AEB103V-Panasonic-datasheet-46744048.pdf?src-supplier=RS+(Formerly+Allied+Electronics); ComponentLink9URL: https://datasheet.octopart.com:443/ERA-3AEB103V-Panasonic-datasheet-10840895.pdf?src-supplier=Future+Electronics; ComponentLink9Description: https://datasheet.octopart.com:443/ERA-3AEB103V-Panasonic-datasheet-10840895.pdf?src-supplier=Future+Electronics; ComponentLink10URL: https://datasheet.octopart.com:443/ERA-3AEB103V-Panasonic-datasheet-8367715.pdf?src-supplier=Future+Electronics; ComponentLink10Description: https://datasheet.octopart.com:443/ERA-3AEB103V-Panasonic-datasheet-8367715.pdf?src-supplier=Future+Electronics; ComponentLink11URL: https://datasheet.octopart.com:443/ERA-3AEB103V-Panasonic-datasheet-12510007.pdf?src-supplier=Future+Electronics; ComponentLink11Description: https://datasheet.octopart.com:443/ERA-3AEB103V-Panasonic-datasheet-12510007.pdf?src-supplier=Future+Electronics; ComponentLink12URL: https://datasheet.octopart.com:443/ERA-3AEB103V-Panasonic-datasheet-11763931.pdf?src-supplier=Future+Electronics; ComponentLink12Description: https://datasheet.octopart.com:443/ERA-3AEB103V-Panasonic-datasheet-11763931.pdf?src-supplier=Future+Electronics; ComponentLink13URL: https://datasheet.octopart.com:443/ERA-3AEB103V-Panasonic-datasheet-5392808.pdf?src-supplier=Future+Electronics; ComponentLink13Description: https://datasheet.octopart.com:443/ERA-3AEB103V-Panasonic-datasheet-5392808.pdf?src-supplier=Future+Electronics; ComponentLink14URL: https://datasheet.octopart.com:443/ERA-3AEB103V-Panasonic-datasheet-154766165.pdf?src-supplier=Master+Electronics; ComponentLink14Description: https://datasheet.octopart.com:443/ERA-3AEB103V-Panasonic-datasheet-154766165.pdf?src-supplier=Master+Electronics; ComponentLink15URL: https://datasheet.octopart.com:443/ERA3AEB103V-Panasonic-datasheet-188913046.pdf?src-supplier=TME; ComponentLink15Description: https://datasheet.octopart.com:443/ERA3AEB103V-Panasonic-datasheet-188913046.pdf?src-supplier=TME; ComponentLink16URL: https://sigma.octopart.com:443/150570796/technical_drawing/Panasonic-ERA3AEB103V.pdf?src-supplier=Panasonic+SCT; ComponentLink16Description: https://sigma.octopart.com:443/150570796/technical_drawing/Panasonic-ERA3AEB103V.pdf?src-supplier=Panasonic+SCT; ComponentLink17URL: https://datasheet.octopart.com:443/ERA3AEB103V-Panasonic-datasheet-138783076.pdf?src-supplier=Burklin+Elektronik; ComponentLink17Description: https://datasheet.octopart.com:443/ERA3AEB103V-Panasonic-datasheet-138783076.pdf?src-supplier=Burklin+Elektronik; ComponentLink18URL: https://datasheet.octopart.com/ERA-3AEB103V-Panasonic-datasheet-78375410.pdf; ComponentLink18Description: https://datasheet.octopart.com/ERA-3AEB103V-Panasonic-datasheet-78375410.pdf; ComponentLink19URL: https://datasheet.octopart.com:443/ERA-3AEB103V-Panasonic-datasheet-10050158.pdf?src-supplier=Arrow+Electronics; ComponentLink19Description: https://datasheet.octopart.com:443/ERA-3AEB103V-Panasonic-datasheet-10050158.pdf?src-supplier=Arrow+Electronics; ComponentLink20URL: https://datasheet.octopart.com:443/ERA-3AEB103V-Panasonic-datasheet-33006989.pdf?src-supplier=Electro+Sonic; ComponentLink20Description: https://datasheet.octopart.com:443/ERA-3AEB103V-Panasonic-datasheet-33006989.pdf?src-supplier=Electro+Sonic
  R61 R62 R72 R74: Tolerance: 0.1%
R64 = Vishay CRCW060318K0FKEAC: CRCW Thick Film Commodity Chip Resistor 0603 Size 18K Ohm 1% 0.1 W 100 ppm/K 2-Pin SMD Paper T/R; Manufacturer: Vishay; Power Rating: 100mW; Temperature Coefficient: 100ppm/°C; Working Voltage: 75V; Supplier: Farnell; Supplier Part Number: CRCW060318K0FKEAC; Manufacturer Part Number: CRCW060318K0FKEAC; RoHS: Compliant; Category: Chip SMD Resistors; Stock: 83050; Pricing: 10=0,0129, 100=0,0106, 500=0,0076, 1000=0,0056, 2500=0,0051, 5000=0,0045 (GBP); Case/Package: 0603; China RoHS: Non-Compliant; Height: 450µm; Lead Free: Lead Free; Length: 1.6mm; Lifecycle Status: Production; Max Operating Temperature: 155°C; Min Operating Temperature: -55°C; Mounting Technology: Surface Mount; Number of Terminals: 2; REACH SVHC: Yes; Tolerance: 1%; Width: 800µm; ComponentLink1URL: https://datasheet.octopart.com:443/CRCW060318K0FKEAC-Vishay-datasheet-175423585.pdf?src-supplier=Newark; ComponentLink1Description: https://datasheet.octopart.com:443/CRCW060318K0FKEAC-Vishay-datasheet-175423585.pdf?src-supplier=Newark; ComponentLink2URL: http://sigma.octopart.com:80/rohs_statement/Vishay-company-15.pdf?src-supplier=Compliance+Statements; ComponentLink2Description: http://sigma.octopart.com:80/rohs_statement/Vishay-company-15.pdf?src-supplier=Compliance+Statements